# Altium schematic sheet USB_HS_DEVICE.SchDoc
size 420 x 297 mm; DocumentNumber: 5; SheetNumber: 5; SheetTotal: 17
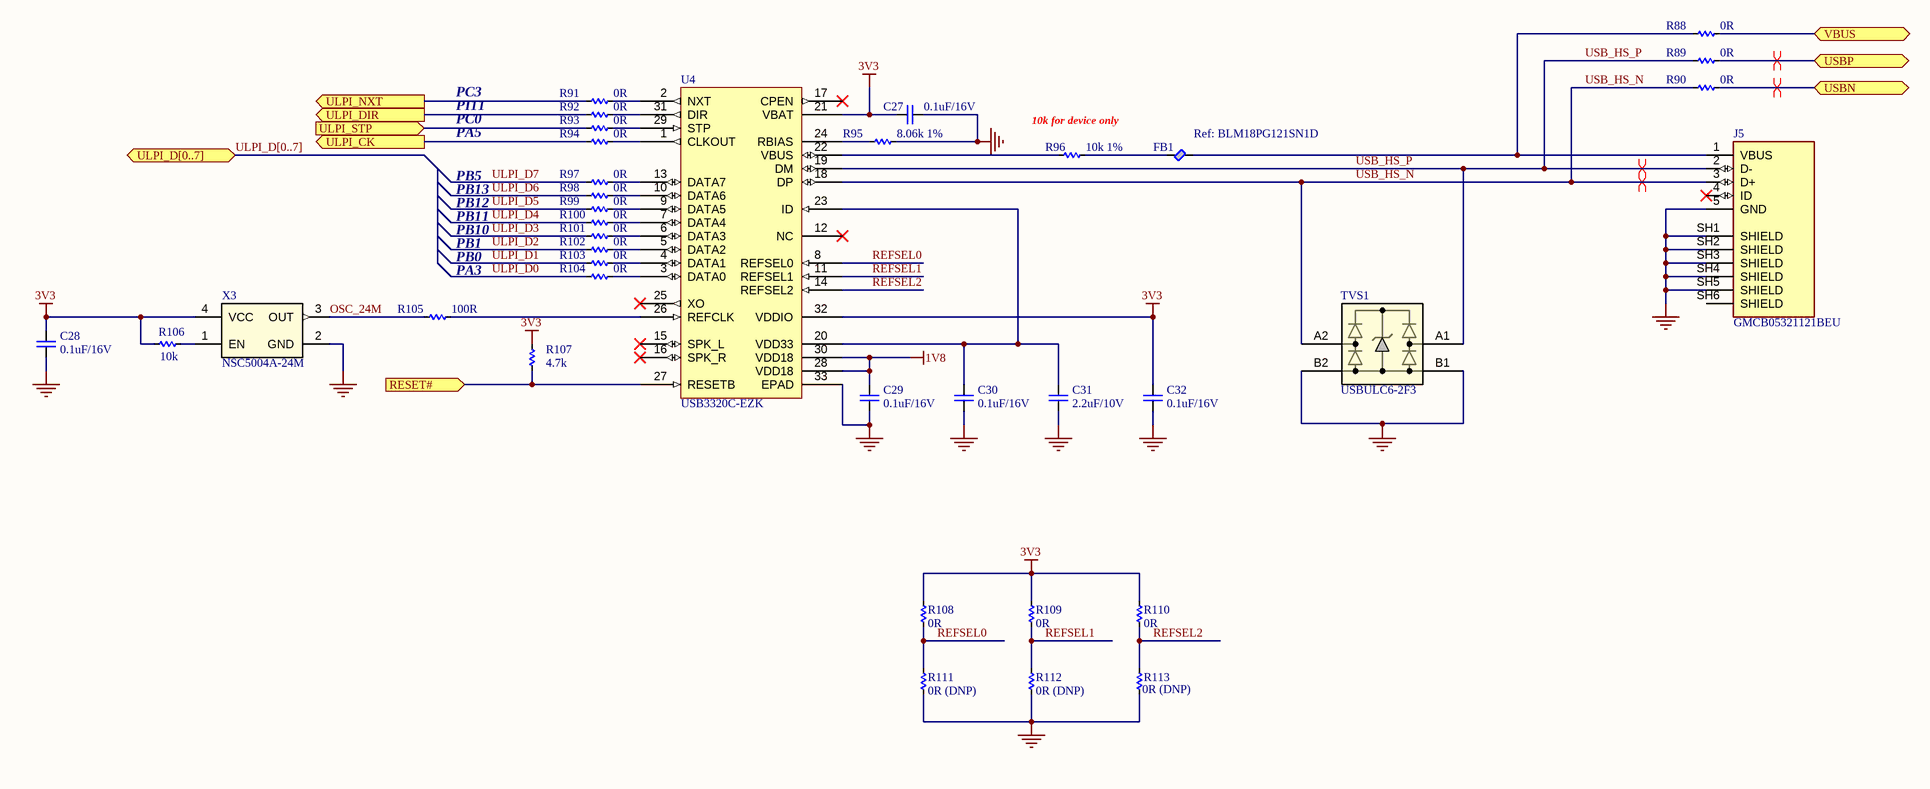
[diagram p0: USB_HS_DEVICE.SchDoc]

## Parts
C27  0.1uF/16V  [CAP_C_1608X80]
C28  0.1uF/16V  [CAP_C_1608X80]
C29  0.1uF/16V  [CAP_C_1608X80]
C30  0.1uF/16V  [CAP_C_1608X80]
C31  2.2uF/10V  [CAP_C_1608X80]
C32  0.1uF/16V  [CAP_C_1608X80]
FB1  FB  [IND_1608x65]  (value not drawn)
J5  GMCB05321121BEU  [AMPHENOL_GMCB05321121BEU]
R88  0R  [RES_C_1608X60]
R89  0R  [RES_C_1608X60]
R90  0R  [RES_C_1608X60]
R91  0R  [RES_C_1608X60]
R92  0R  [RES_C_1608X60]
R93  0R  [RES_C_1608X60]
R94  0R  [RES_C_1608X60]
R95  8.06k 1%  [RES_C_1608X60]
R96  10k 1%  [RES_C_1608X60]
R97  0R  [RES_C_1608X60]
R98  0R  [RES_C_1608X60]
R99  0R  [RES_C_1608X60]
R100  0R  [RES_C_1608X60]
R101  0R  [RES_C_1608X60]
R102  0R  [RES_C_1608X60]
R103  0R  [RES_C_1608X60]
R104  0R  [RES_C_1608X60]
R105  100R  [RES_C_1608X60]
R106  10k  [RES_C_1608X60]
R107  4.7k  [RES_C_1608X60]
R108  0R  [RES_C_1608X60]
R109  0R  [RES_C_1608X60]
R110  0R  [RES_C_1608X60]
R111  0R (DNP)  [RES_C_1608X60]
R112  0R (DNP)  [RES_C_1608X60]
R113  0R (DNP)  [RES_C_1608X60]
TVS1  USBULC6-2F3  [FLIPCHIP4_USBUL_STM]
U4  USB3320C-EZK  [QFN32_5X5MC_MCH]
X3  NSC5004A-24M  [NSC5004D-25M]

## Ports
RESET# (in), ULPI_CK (out), ULPI_D[0..7] (bidir), ULPI_DIR (out), ULPI_NXT (out), ULPI_STP (in), USBN (bidir), USBP (bidir), VBUS (bidir)

## Nets
1V8: C29.2 U4.28(VDD18) U4.30(VDD18)
3V3: C27.2 C28.2 C32.2 R106.2 R107.1 R108.1 R109.1 R110.1 U4.21(VBAT) U4.32(VDDIO) X3.4(VCC)
GND: C27.1 C28.1 C29.1 C30.1 C31.1 C32.1 J5.5(GND) J5.SH1(SHIELD) J5.SH2(SHIELD) J5.SH3(SHIELD) J5.SH4(SHIELD) J5.SH5(SHIELD) R95.2 R111.2 R112.2 R113.2 TVS1.B1 TVS1.B2 U4.33(EPAD) X3.2(GND)
OSC_24M: R105.2 X3.3(OUT)
REFSEL0: R108.2 R111.1 U4.8(REFSEL0)
REFSEL1: R109.2 R112.1 U4.11(REFSEL1)
REFSEL2: R110.2 R113.1 U4.14(REFSEL2)
RESET#: R107.2 U4.27(RESETB) ; port RESET#
ULPI_CK: R94.2 ; port ULPI_CK
ULPI_D0: R104.2
ULPI_D1: R103.2
ULPI_D2: R102.2
ULPI_D3: R101.2
ULPI_D4: R100.2
ULPI_D5: R99.2
ULPI_D6: R98.2
ULPI_D7: R97.2
ULPI_DIR: R92.2 ; port ULPI_DIR
ULPI_NXT: R91.2 ; port ULPI_NXT
ULPI_STP: R93.2 ; port ULPI_STP
USB_HS_N: J5.3(D+) R90.1 TVS1.A2 U4.18(DP)
USB_HS_P: J5.2(D-) R89.1 TVS1.A1 U4.19(DM)
USBN: R90.2 ; port USBN
USBP: R89.2 ; port USBP
VBUS: R88.2 ; port VBUS
NetC30_2: C30.2 C31.2 U4.20(VDD33) U4.23(ID)
NetFB1_1: FB1.1 R96.2
NetFB1_2: FB1.2 J5.1(VBUS) R88.1
NetR91_1: R91.1 U4.2(NXT)
NetR92_1: R92.1 U4.31(DIR)
NetR93_1: R93.1 U4.29(STP)
NetR94_1: R94.1 U4.1(CLKOUT)
NetR95_1: R95.1 U4.24(RBIAS)
NetR96_1: R96.1 U4.22(VBUS)
NetR97_1: R97.1 U4.13(DATA7)
NetR98_1: R98.1 U4.10(DATA6)
NetR99_1: R99.1 U4.9(DATA5)
NetR100_1: R100.1 U4.7(DATA4)
NetR101_1: R101.1 U4.6(DATA3)
NetR102_1: R102.1 U4.5(DATA2)
NetR103_1: R103.1 U4.4(DATA1)
NetR104_1: R104.1 U4.3(DATA0)
NetR105_1: R105.1 U4.26(REFCLK)
NetR106_1: R106.1 X3.1(EN)

Not connected (* = marked no-connect by the designer): J5 4(ID)* SH6(SHIELD); U4 12(NC)* 15(SPK_L)* 16(SPK_R)* 17(CPEN)* 25(XO)*

## Buses and harness runs
bus ULPI_D[0..7] = port ULPI_D[0..7]

## Layout directives
differential pair: USB_HS_N, USB_HS_P, USBN, USBP

## Notes on the sheet
- PC3
- PI11
- PB5
- PC0
- PA5
- (near R96) 10k for device only
- (near FB1) Ref: BLM18PG121SN1D
- PB1
- PB10
- PB11
- PB12
- PB13
- (near R105) PA3
- (near R105) PB0
- Project:
- BEE-PC1
- Sub-system:
- NANORACK_EXP_CONTROLLER
- Design by:
- SANG HUYNH
- BAO BUI Q.
- Sheet title:
- Sheet
- A3
- of
- Checked by:
- Approved by:
- VU PHAM
- Revision:
- Document No:
- V1.2.2
- Size:
- Date:

## Library data of the parts
C27-C32 = CAP_SMD: CAP_Chip; Value: 33pF
FB1 = FB: FERRITE BEAD
J5 = GMCB05321121BEU: Micro USB 2.0 Type B Receptacle Right Angle SMT, Tape and Reel Packaging; MF: Amphenol Commercial Products; SnapEDA_Link: https://www.snapeda.com/parts/GMCB05321121BEU/Amphenol/view-part/?ref=snap; Package: None; Value: *; MP: GMCB05321121BEU; Check_prices: https://www.snapeda.com/parts/GMCB05321121BEU/Amphenol/view-part/?ref=eda
R88-R113 = _RES_B_2: RES
TVS1 = USBULC6-2F3: TVS DIODE 3VWM 4FLIPCHIP; Manufacturer_Name: STMicroelectronics; Copyright: Copyright (C) 2025 Ultra Librarian. All rights reserved.; Manufacturer_Part_Number: USBULC6-2F3; RefDes: RefDes; Type: Type
U4 = USB3320C-EZK: IC TRANSCEIVER HALF 1/1 32QFN
X3 = NSC5004D-25M: XTAL OSC XO 24.0000MHZ CMOS SMD; Manufacturer_Name: NDK; Manufacturer_Part_Number: NSC5004A-25M; Type: Oscillators; Copyright: Copyright (C) 2025 Ultra Librarian. All rights reserved.; RefDes: RefDes